# EasyEDA Pro project 直插式交直流电流检测.eprj

# Schematic Schematic3_1
Board Name: 基于CC6920的电流采样; Create Date: 2026-01-25; Page Name: P1; Project Name: 直插式交直流电流检测; Schematic Name: Schematic3_1; Update Date: 2026-03-20; Company: Werner; Page Size: A4; Version: V1.0
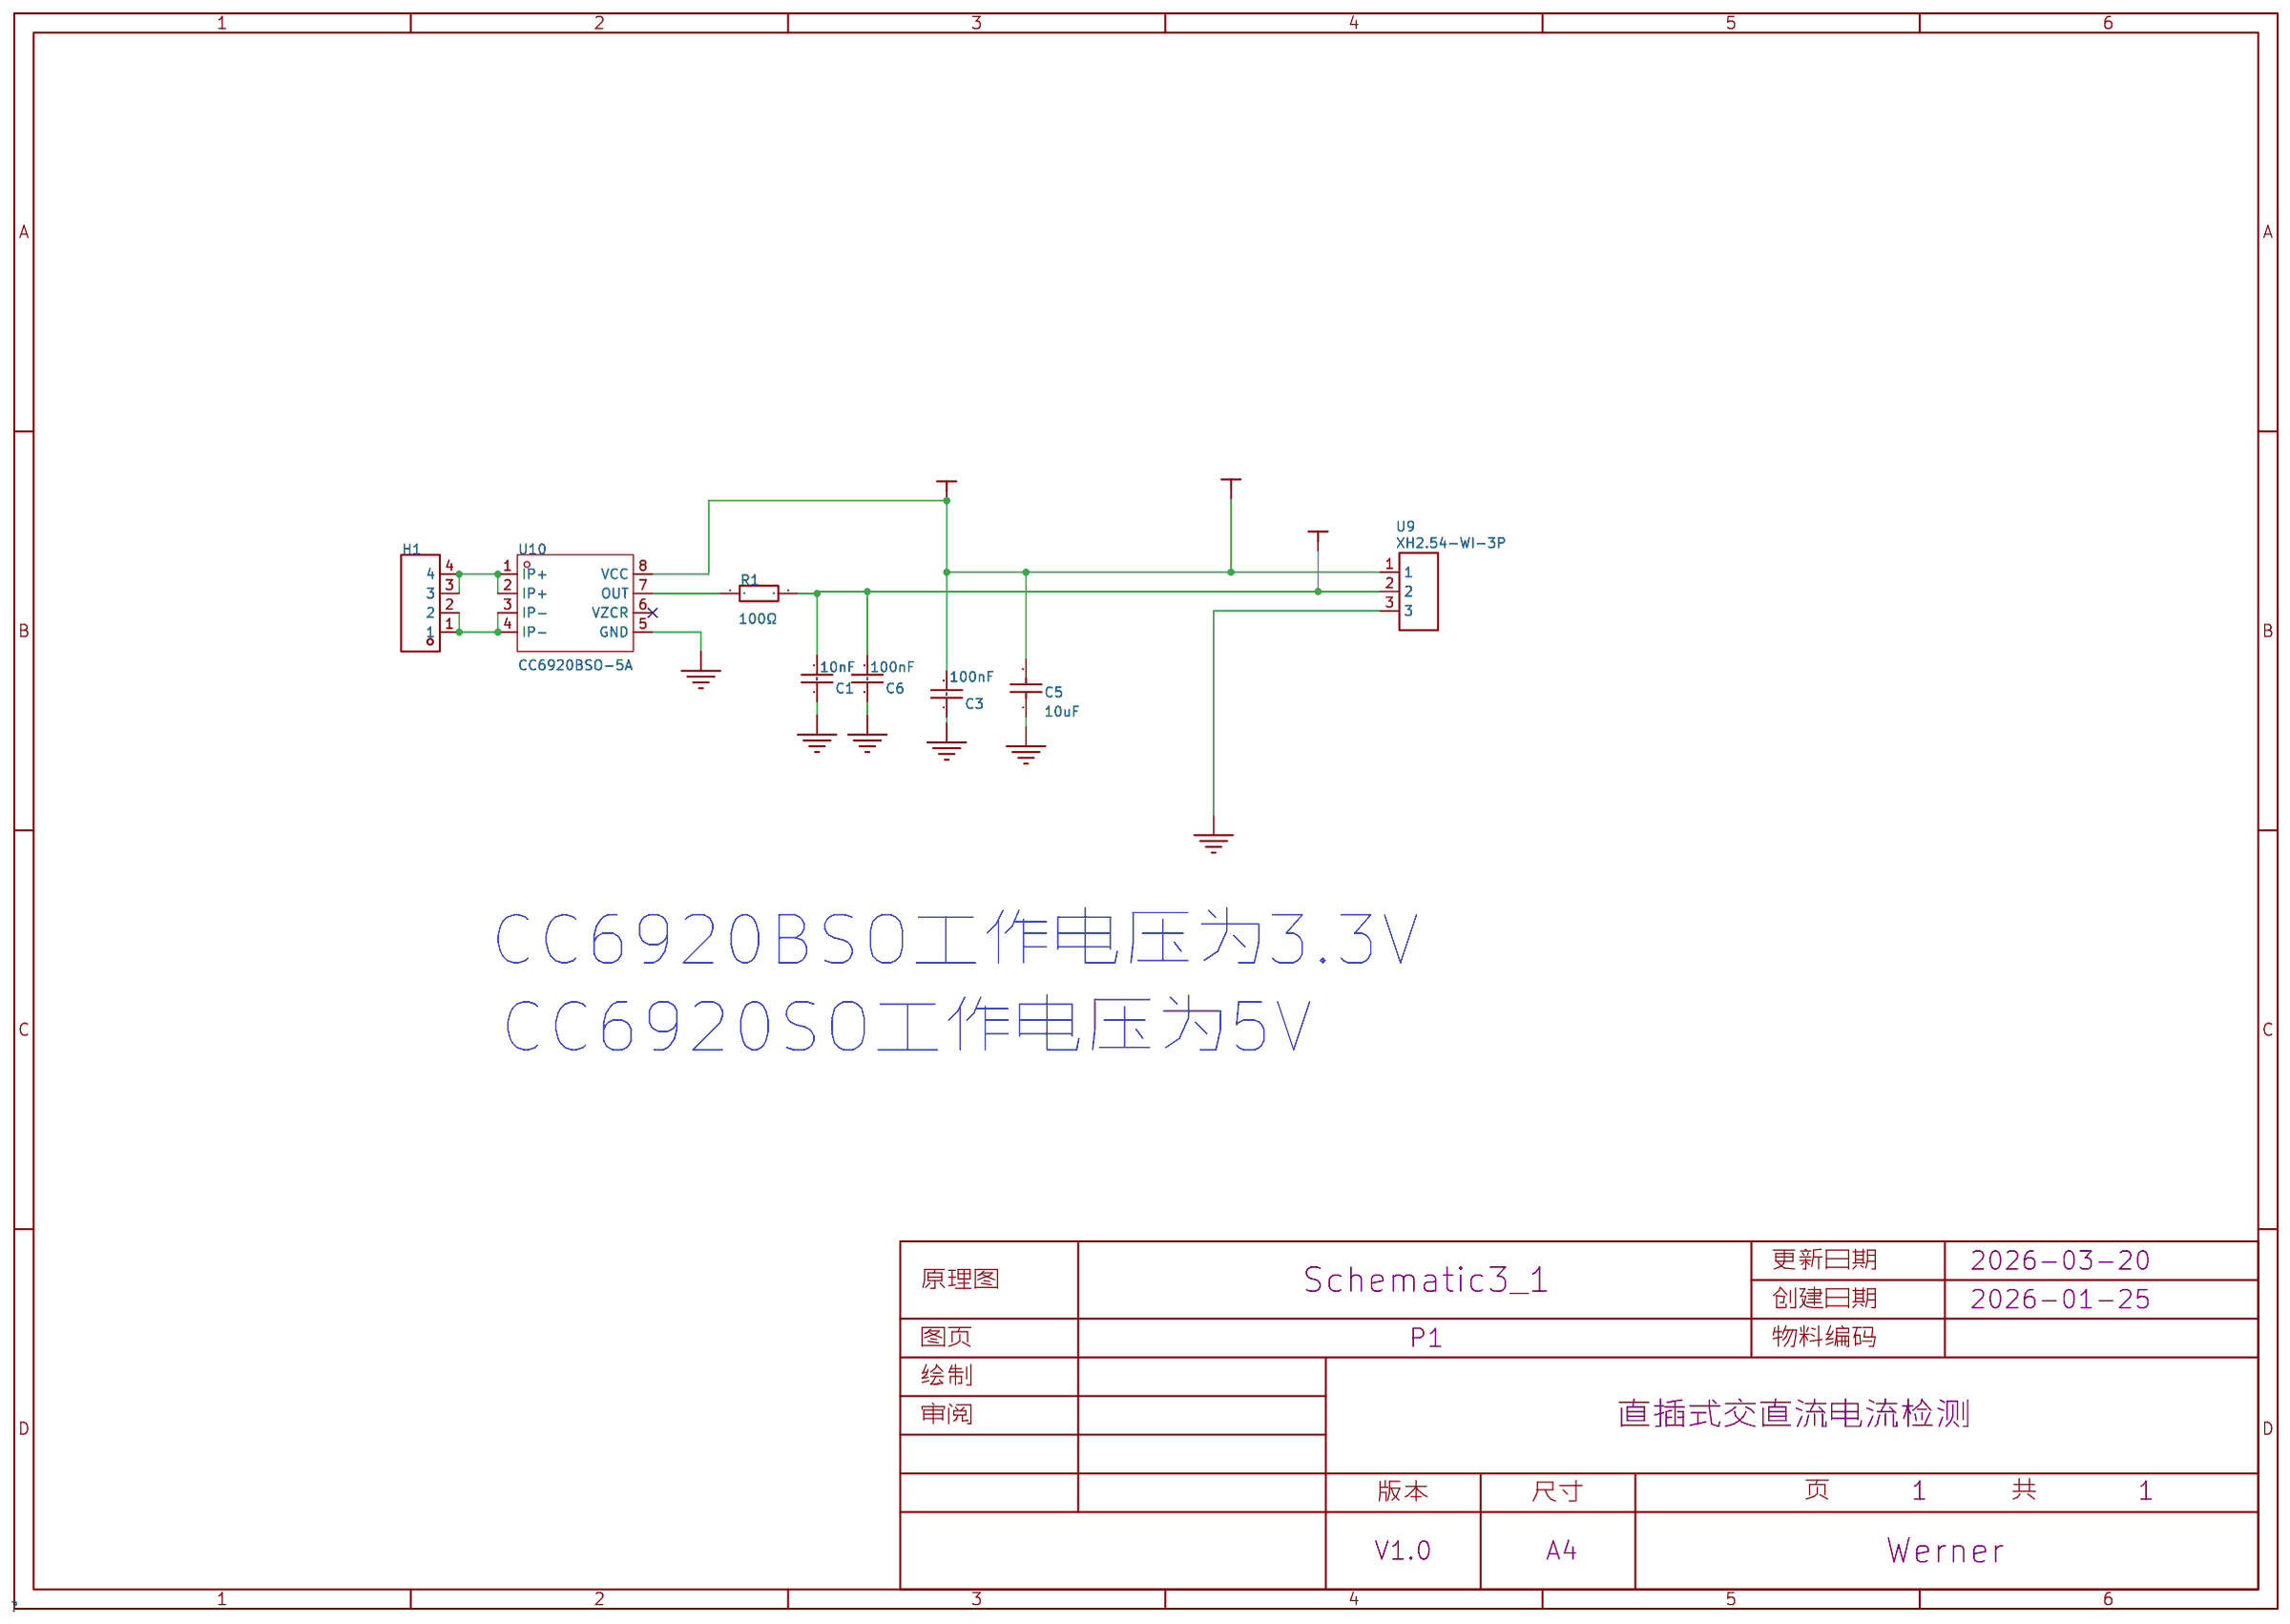
[diagram p0: schematic sheet]

## Parts
C1  10nF  [C0603]
C3  100nF  [C0603]
C5  10uF  [C0603]
C6  100nF  [C0603]
H1  PZ254V-11-04P  [HDR-TH_4P-P2.54-V-M]
R1  100Ω  [Res_0603]
U9  XH2.54-WI-3P  [CONN-TH_XH2.54-WI-3P]
U10  CC6920BSO-5A  [SOP-8_L4.9-W3.9-P1.27-LS6.0-BL]

## Library data of the parts
C1 C3 C6 = C0603
C5 = C1206: LCSC Part Name: 100nF ±10% 50V; Supplier Part: C24497; Manufacturer: SAMSUNG(三星); Manufacturer Part: CL31B104KBCNNNC; Supplier Footprint: 1206; JLCPCB Part Class: Basic Part; Datasheet: https://atta.szlcsc.com/upload/public/pdf/source/20160218/1457707763339.pdf; Supplier: LCSC; Tolerance: ±10%; Voltage Rated: 50V; Temperature Coefficient: X7R
H1 = PZ254V-11-04P: LCSC Part Name: 间距:2.54mm 1x4P 直插 方针; Supplier Part: C2691448; Manufacturer: XFCN(兴飞); Supplier Footprint: 插件,P=2.54mm; JLCPCB Part Class: 扩展库; Datasheet: https://atta.szlcsc.com/upload/public/pdf/source/20200309/C492403_F9F19131791D08044AD4F84F8E751A34.pdf; Supplier: LCSC; Pin Structure: 1x4P; Pitch: 2.54mm; Circluar Pins/Square Pins: 方针; Mounting Type: 直插; Number of Rows: 单排; Number of Pins: 4P; Current Rating (Max): 3A; Voltage Rating (Max): 250V; Length of Mating Pin: 6mm; Insulation Height: 2.5mm; Length of End Connection Pin: 3mm; Operating Temperature Range: -40℃~+105℃; Color: 黑色
R1 = R0603
U9 = XH2.54-WI-3P: Supplier: LCSC; Supplier Part: C9900005531; Manufacturer: null; JLCPCB Part Class: Extended Part
U10 = CC6920BSO-5A: Supplier Part: C2880430; Manufacturer: CrossChip(成都芯进); Supplier Footprint: SOP-8; JLCPCB Part Class: 扩展库; Datasheet: https://atta.szlcsc.com/upload/public/pdf/source/20241128/C0E6ECA7AE7321445B7BA60B45AD2C20.pdf; Supplier: LCSC; Current Range: -5A~5A; Supply Voltage: 3.3V; Isolated Voltage Withstand: 3500Vrms; Sensitivity: 264mV/A; Standby Current: 20mA; Operating Temperature: -40℃~+125℃

## Nets
3.3V: C3.2 C5.2 U9.1 U10.8(VCC)
GND: C1.1 C3.1 C5.1 C6.1 U9.3 U10.5(GND)
VOUT: C1.2 C6.2 R1.2 U9.2
$9N245: R1.1 U10.7(OUT)
$9N3333: H1.1 H1.2 U10.3(IP-) U10.4(IP-)
$9N3336: H1.3 H1.4 U10.1(IP+) U10.2(IP+)

Not connected (* = marked no-connect by the designer): U10 6(VZCR)*

## Notes on the sheet
- CC6920BSO工作电压为3.3V
- CC6920SO工作电压为5V

# Board PCB3_1
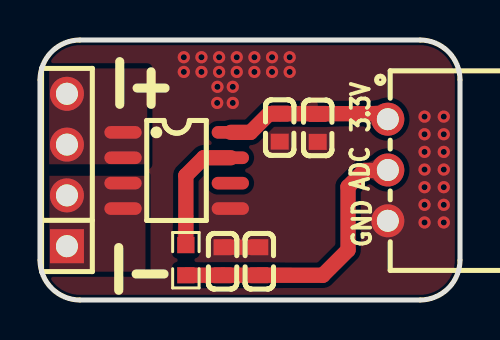
[diagram p1: board, top side]
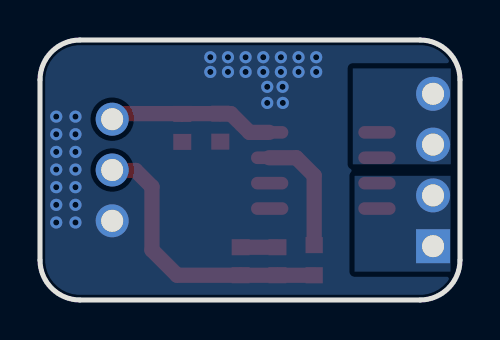
[diagram p2: board, bottom side, seen from below]

Outline 21 x 13 mm; copper layers: Top Layer, Bottom Layer. Coordinates in mm from the lower left corner of the outline.
Outline path: 0,11 0,2 arc(0.59,0.59) 2,0 19,0 arc(20.41,0.59) 21,2 21,11 arc(20.41,12.41) 19,13 2,13 arc(0.59,12.41) 0,11
Stack: Top Layer 0.035mm / Dielectric1 1.51mm FR4 er 4.5 / Bottom Layer 0.035mm

## Design rules (mm)
spacing copperThickness1oz (default): track to track 0.102, other pairs 0.152 to 0.3
spacing copperThickness2oz: track to track 0.203, other pairs 0.152 to 0.3
spacing Plane_innerPlane: track to track 0.102, other pairs 0.152 to 0.3
spacing Copper_copperRegion: track to track 0.102, other pairs 0.152 to 0.3
track width copperThickness1oz (default): min 0.127, default 0.254, max 2.54
track width copperThickness2oz: min 0.203, default 0.254, max 2.54
differential pair differentialPair (default): width min 0.127, default 0.254, max 2.54; gap min 0.152, default 0.152
via viaSize (default): diameter min 0.5, default 0.61, max 10; hole min 0.3, default 0.305, max 6.3
pour e80 uses Copper_copperRegion
pour e82 uses Copper_copperRegion

## Placement (name value [footprint] x y rotation side)
C1  10nF  [C0603]  9.13 1.94 270 top
C3  100nF  [C0603]  13.89 8.61 90 top
C5  10uF  [C0603]  11.99 8.62 90 top
C6  100nF  [C0603]  10.97 1.94 270 top
H1  PZ254V-11-04P  [HDR-TH_4P-P2.54-V-M]  1.35 6.5 90 top
R1  100Ω  [Res_0603]  7.29 1.99 270 top
U9  XH2.54-WI-3P  [CONN-TH_XH2.54-WI-3P]  17.39 6.5 270 top
U10  CC6920BSO-5A  [SOP-8_L4.9-W3.9-P1.27-LS6.0-BL]  6.83 6.48 270 top

## Footprints (pads in the part's own frame, mm; a bottom-side part is the same pattern mirrored in y, then rotated)
C0603
  rect 0.8x0.9 smd: 1(-0.7,0) 2(0.7,0)
CONN-TH_XH2.54-WI-3P
  round 1.65 hole 1.1: 1(-2.54,0) 2(0,0) 3(2.54,0)
HDR-TH_4P-P2.54-V-M
  rect 1.7x1.7 hole 1.1: 1(-3.81,0)
  round 1.7 hole 1.1: 2(-1.27,0) 3(1.27,0) 4(3.81,0)
Res_0603
  rect 0.806x0.864 smd: 1(-0.754,0) 2(0.752,0)
SOP-8_L4.9-W3.9-P1.27-LS6.0-BL
  oval 0.63x1.865 smd: 1(-1.905,-2.683) 2(-0.635,-2.683) 3(0.635,-2.683) 4(1.905,-2.683) 5(1.905,2.683) 6(0.635,2.683) 7(-0.635,2.683) 8(-1.905,2.683)

## Nets
As in the schematic.

Pads without a net: U10 6

## Via types
v1: diameter 0.61, hole 0.305, Top Layer to Bottom Layer, 32 vias

## Routing (per net, layer and track width the routed paths; a pad name or vN(x,y) marks a point on that pad's centre or on a via; arc(x,y) is an arc through that point)
3.3V: length 8.4
  Top Layer w0.762: 13.87,9.32 C5.2 11.46,9.32 10.52,8.38 9.54,8.38 ; 13.87,9.32 C3.2 ; 13.87,9.32 17.16,9.32 ; U9.1 17.16,9.27
GND: length 1.8
  Top Layer w0.762: C1.1 C6.1
  vias: v1(7.19,12.14) v1(7.19,11.4) v1(8.07,12.14) v1(8.07,11.4) v1(8.87,10.66) v1(8.86,9.85) v1(8.96,12.14) v1(8.96,11.4) v1(9.64,10.66) v1(9.64,9.85) v1(9.84,12.14) v1(9.84,11.4) v1(10.72,12.14) v1(10.72,11.4) v1(11.6,12.14) v1(11.6,11.4) v1(12.48,12.14) v1(12.48,11.4) v1(19.23,9.17) v1(19.23,8.29) v1(19.23,7.4) v1(19.23,6.52) v1(19.23,5.64) v1(19.23,4.76) v1(19.23,3.88) v1(20.19,9.17) v1(20.19,8.29) v1(20.19,7.4) v1(20.19,6.52) v1(20.19,5.64) v1(20.19,4.76) v1(20.19,3.88)
VOUT: length 14.1
  Top Layer w0.762: U9.2 17.37,6.48 16.22,6.48 15.4,5.66 15.4,2.5 14.14,1.24 C6.2 ; R1.2 10.96,1.24
$9N245: length 6.1
  Top Layer w0.762: R1.1 7.29,6.22 8.18,7.11 9.54,7.11

## Copper pours and planes (outline as drawn; the poured copper is in the pictures)
GND on Top Layer: -4.13,14.28 22.19,14.28 22.19,-2.4 -4.13,-2.4
GND on Bottom Layer: -3.47,13.46 23.05,13.46 23.05,-1.12 -3.47,-1.12
$9N3333 on Top Layer: 0.47,6.21 5.27,6.21 5.27,1.42 0.47,1.42
$9N3333 on Bottom Layer: 0.47,6.21 5.27,6.21 5.27,1.42 0.47,1.42
$9N3336 on Top Layer: 0.46,11.58 5.36,11.58 5.36,6.79 0.46,6.79
$9N3336 on Bottom Layer: 0.46,11.58 5.36,11.58 5.36,6.79 0.46,6.79

Small or netless copper shapes (teardrops, artwork), in the pictures only: 13 on Top Layer

## Text on the board
Top Silkscreen Layer: ADC | 3.3V | GND | I- | I+
